# Altium project IMX385_EVB_revA.PrjPcb
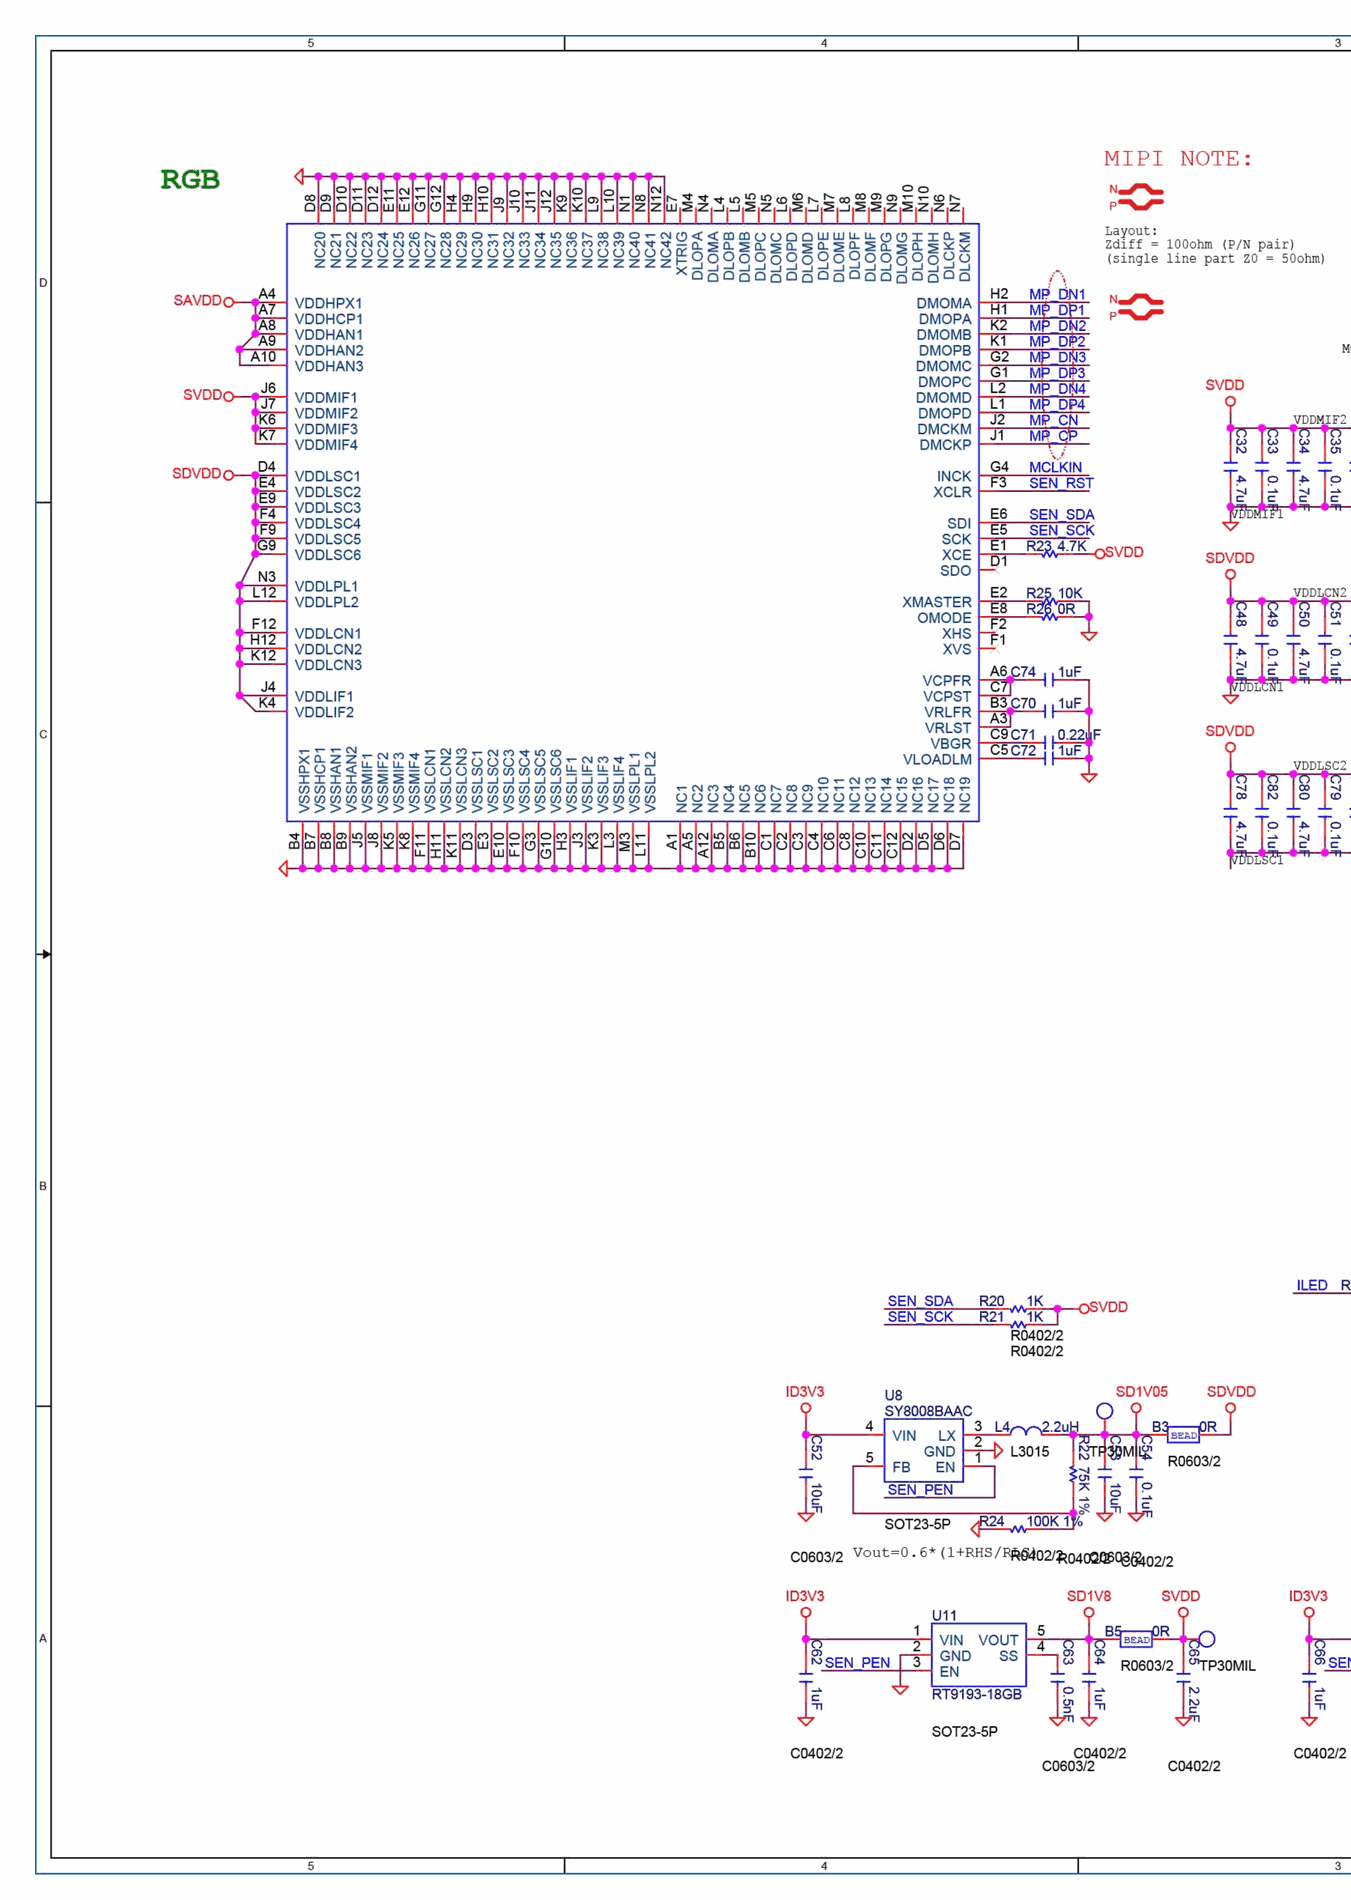
[diagram p0: IMX385_EVB_revA.SchDoc, top left]
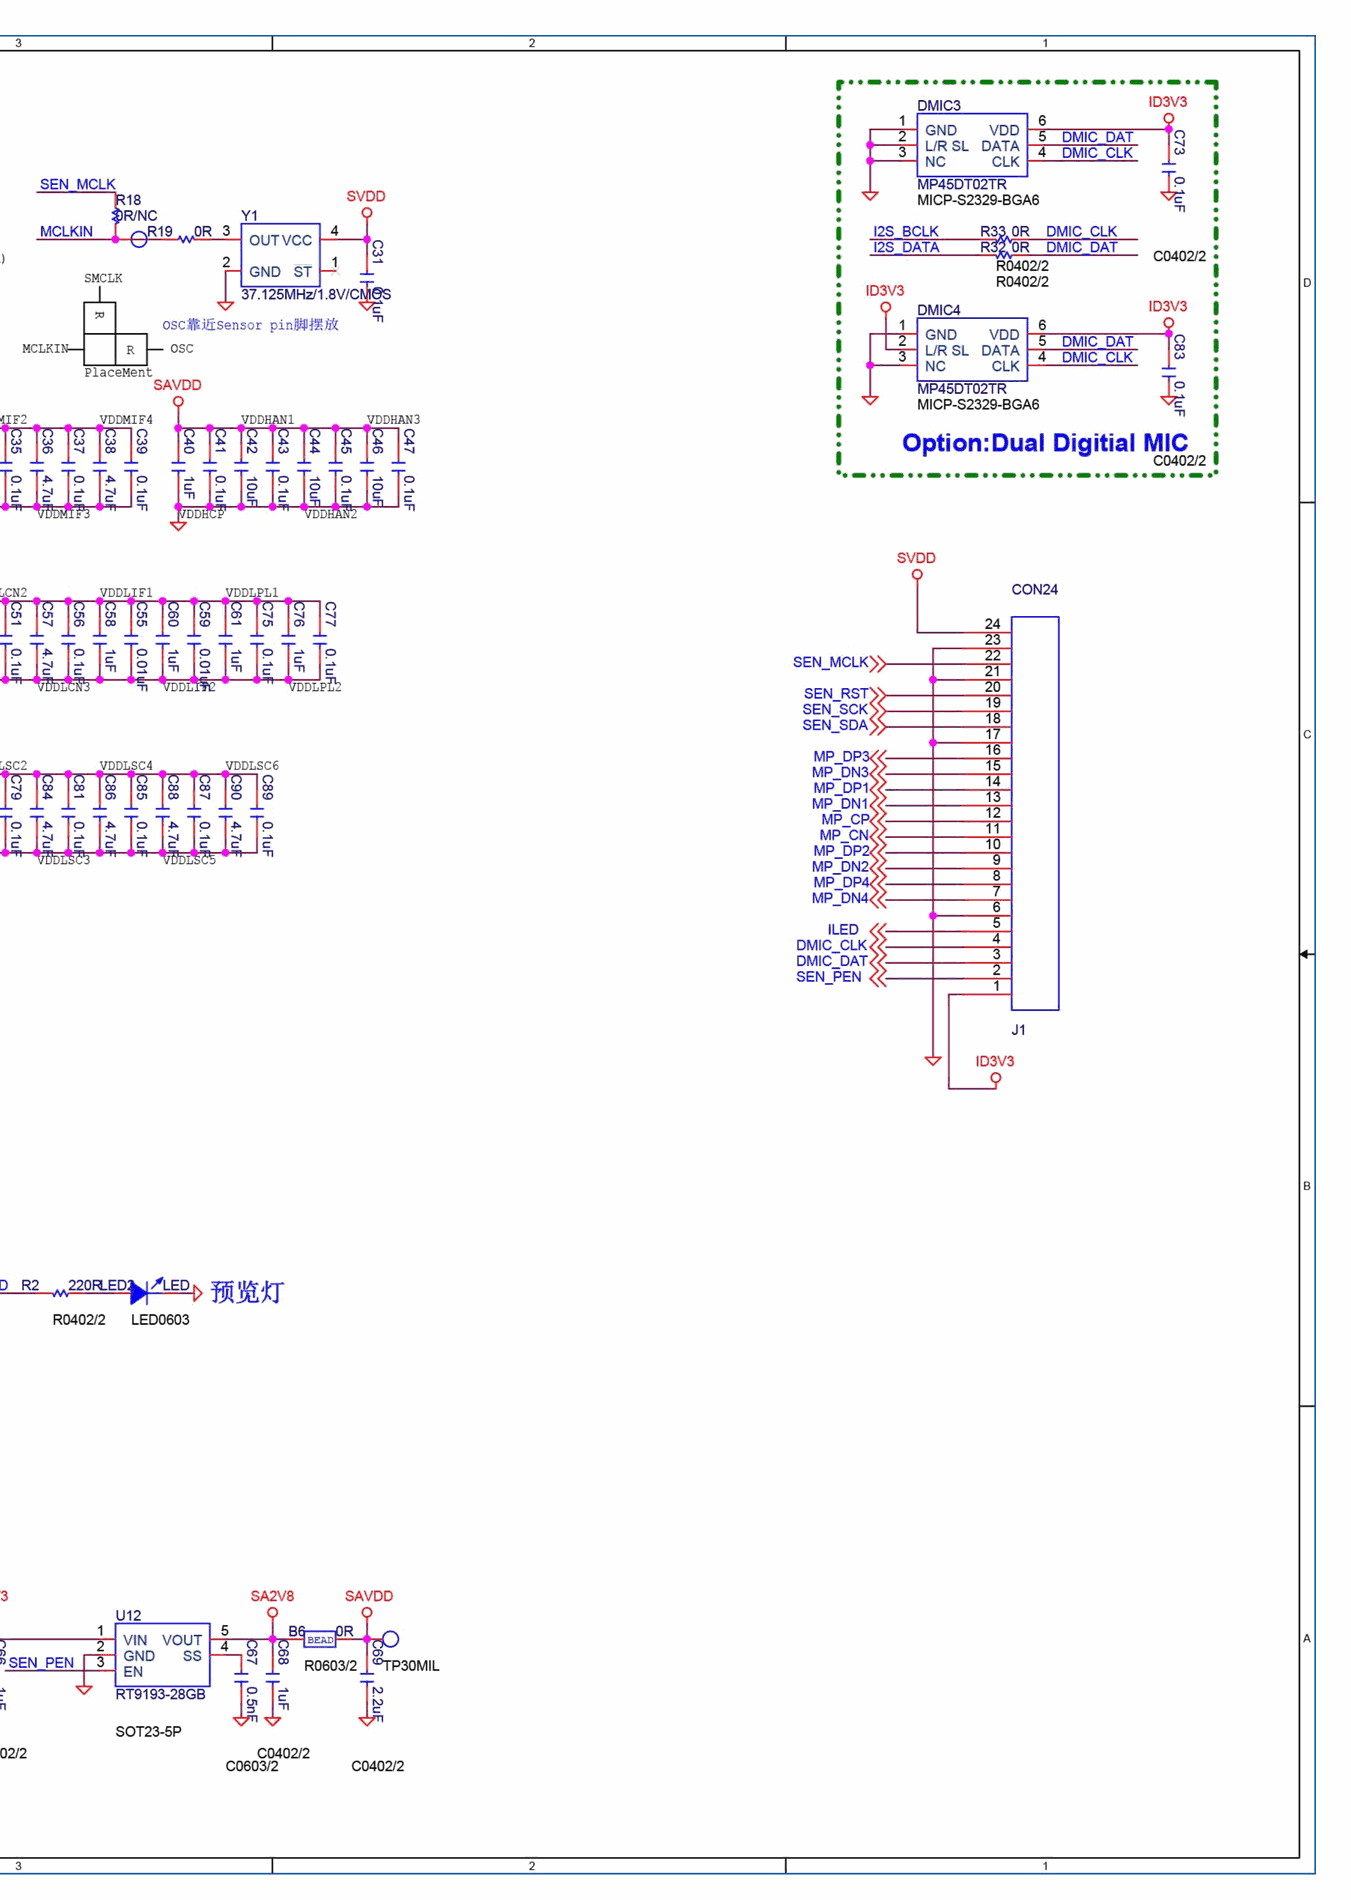
[diagram p1: IMX385_EVB_revA.SchDoc, top right]
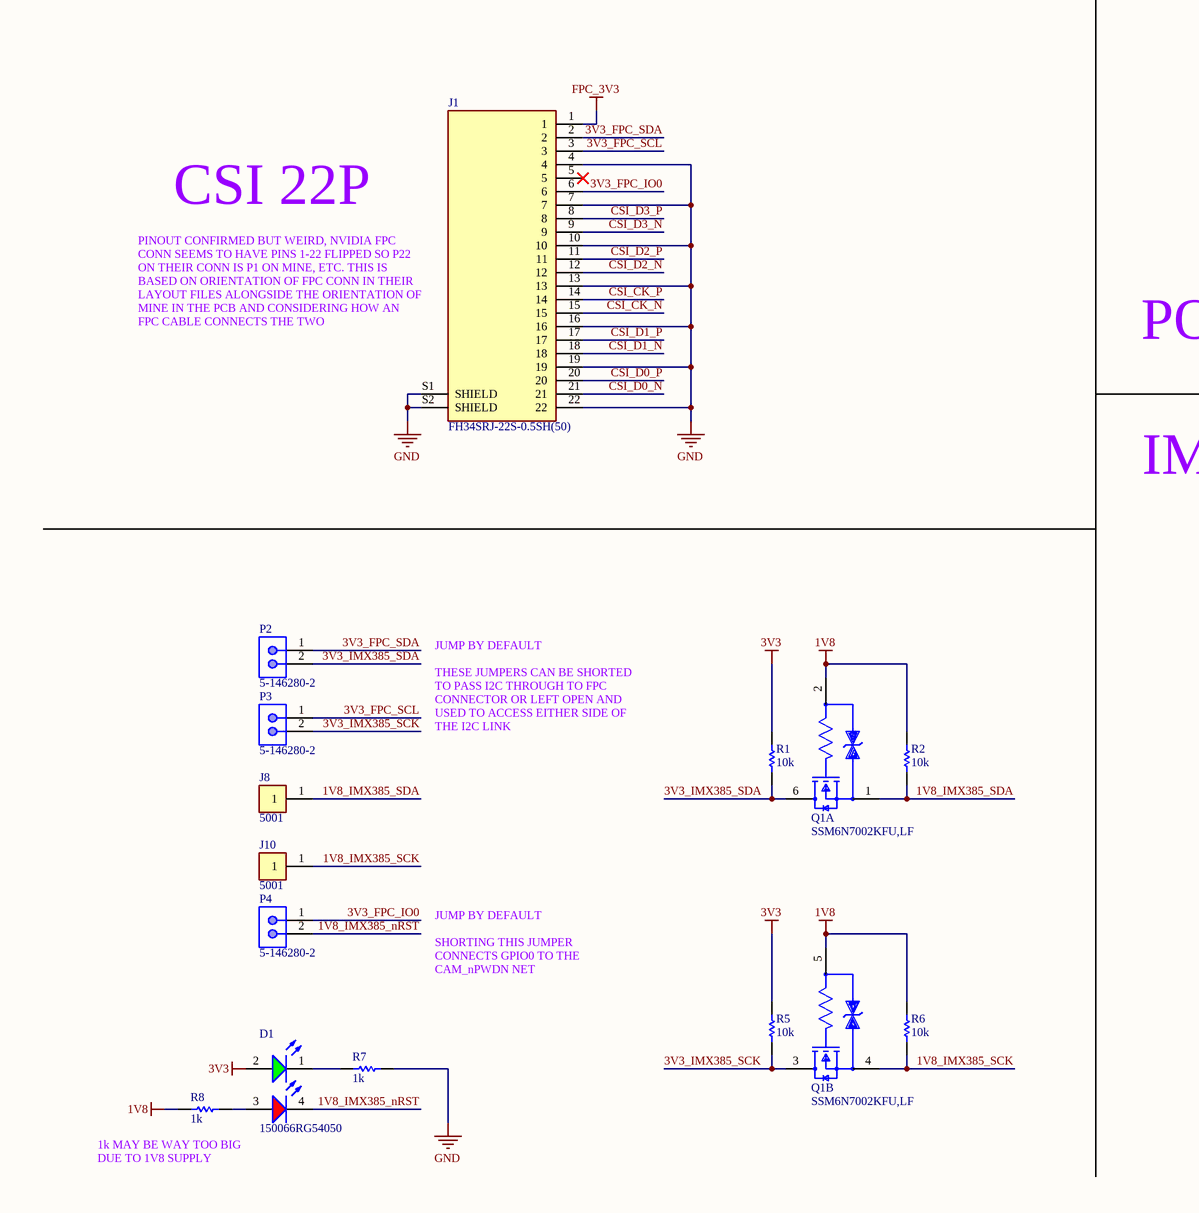
[diagram p2: IMX385_EVB_revA.SchDoc, bottom left]
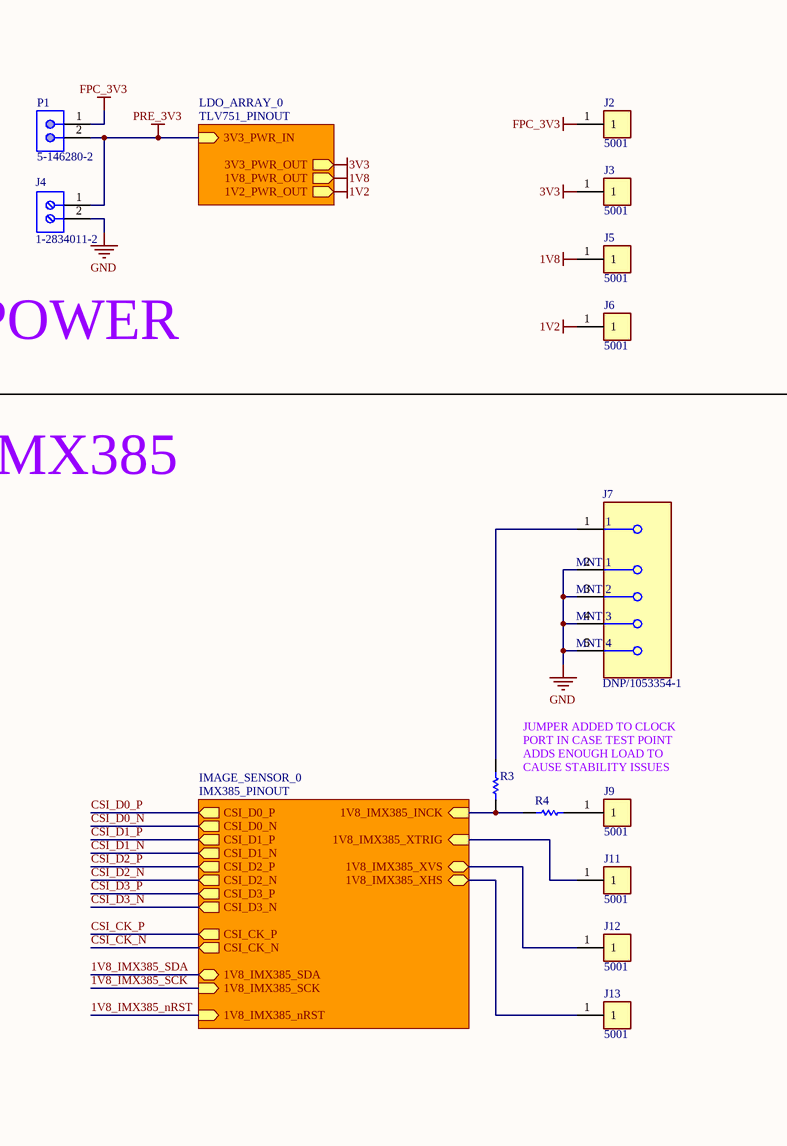
[diagram p3: IMX385_EVB_revA.SchDoc, bottom right]
3 sheets, 109 parts. Net scope: hierarchical (ports join the sheet entries above them; power ports are global).
Board file: IMX385_EVB_revA.PcbDoc
Sheets:
  IMX385_EVB_revA.SchDoc
    IMAGE_SENSOR_0 = IMX385_PINOUT.SchDoc
    LDO_ARRAY_0 = TLV751_PINOUT.SchDoc

## Sheet IMX385_EVB_revA.SchDoc
size B; SheetNumber: 1; SheetTotal: 3

### Parts
D1  150066RG54050  [WL-SBCD_0606]
J1  FH34SRJ-22S-0.5SH(50)  [FH34SRJ-22S-0.5SH(50)-Footprint-1]
J2  5001  [FP-5001-MFG]
J3  5001  [FP-5001-MFG]
J4  1-2834011-2  [1-2834011-2-Footprint-1]
J5  5001  [FP-5001-MFG]
J6  5001  [FP-5001-MFG]
J7  DNP/1053354-1  [FP-1053354-1-MFG]
J8  5001  [FP-5001-MFG]
J9  5001  [FP-5001-MFG]
J10  5001  [FP-5001-MFG]
J11  5001  [FP-5001-MFG]
J12  5001  [FP-5001-MFG]
J13  5001  [FP-5001-MFG]
P1  5-146280-2  [TECO-5-146280-2_V]
P2  5-146280-2  [TECO-5-146280-2_V]
P3  5-146280-2  [TECO-5-146280-2_V]
P4  5-146280-2  [TECO-5-146280-2_V]
Q1  SSM6N7002KFU,LF  [FP-SSOP6-P-0_65A-MFG]  (parts A,B of 2)
R1  10k  [R0603B]
R2  10k  [R0603B]
R3  DNP  [RESC1005X40X25ML05T05]  (value not drawn)
R4  0402 JUMPER  [RESC1005X40X25ML05T05]  (value not drawn)
R5  10k  [R0603B]
R6  10k  [R0603B]
R7  1k  [R0603B]
R8  1k  [R0603B]

### Sub-sheets
IMAGE_SENSOR_0 = IMX385_PINOUT: CSI_D0_P (out), CSI_D0_N (out), CSI_D1_P (out), CSI_D1_N (out), CSI_D2_P (out), CSI_D2_N (out), CSI_D3_P (out), CSI_D3_N (out), CSI_CK_P (out), CSI_CK_N (out), 1V8_IMX385_SDA (bidir), 1V8_IMX385_SCK (in), 1V8_IMX385_nRST (in), 1V8_IMX385_INCK (in), 1V8_IMX385_XHS (bidir), 1V8_IMX385_XVS (bidir), 1V8_IMX385_XTRIG (in)
LDO_ARRAY_0 = TLV751_PINOUT: 3V3_PWR_IN (in), 1V2_PWR_OUT (out), 1V8_PWR_OUT (out), 3V3_PWR_OUT (out)

### Nets
1V2: J6.1 ; sheet LDO_ARRAY_0/1V2_PWR_OUT  [project net 1V2_PWR_OUT]
1V8: J5.1 Q1.2(Gate1) Q1.5(Gate2) R2.2 R6.2 R8.2 ; sheet LDO_ARRAY_0/1V8_PWR_OUT  [project net 1V8_PWR_OUT]
3V3: D1.2(A) J3.1 R1.2 R5.2 ; sheet LDO_ARRAY_0/3V3_PWR_OUT
FPC_3V3: J1.1 J2.1 P1.1
GND: J1.4 J1.7 J1.10 J1.13 J1.16 J1.19 J1.22 J1.S1(SHIELD) J1.S2(SHIELD) J4.2 J7.2(MNT_1) J7.3(MNT_2) J7.4(MNT_3) J7.5(MNT_4) R7.1
PRE_3V3: J4.1 P1.2 ; sheet LDO_ARRAY_0/3V3_PWR_IN  [project net 3V3_PWR_IN]
1V8_IMX385_INCK: R3.1 R4.1 ; sheet IMAGE_SENSOR_0/1V8_IMX385_INCK
1V8_IMX385_nRST: D1.4(K) P4.2 ; sheet IMAGE_SENSOR_0/1V8_IMX385_nRST
1V8_IMX385_SCK: J10.1 Q1.4(Source2) R6.1 ; sheet IMAGE_SENSOR_0/1V8_IMX385_SCK
1V8_IMX385_SDA: J8.1 Q1.1(Source1) R2.1 ; sheet IMAGE_SENSOR_0/1V8_IMX385_SDA
1V8_IMX385_XHS: J13.1 ; sheet IMAGE_SENSOR_0/1V8_IMX385_XHS
1V8_IMX385_XTRIG: J11.1 ; sheet IMAGE_SENSOR_0/1V8_IMX385_XTRIG
1V8_IMX385_XVS: J12.1 ; sheet IMAGE_SENSOR_0/1V8_IMX385_XVS
3V3_FPC_IO0: J1.6 P4.1
3V3_FPC_SCL: J1.3 P3.1
3V3_FPC_SDA: J1.2 P2.1
3V3_IMX385_SCK: P3.2 Q1.3(Drain2) R5.1
3V3_IMX385_SDA: P2.2 Q1.6(Drain1) R1.1
CSI_CK_N: J1.15 ; sheet IMAGE_SENSOR_0/CSI_CK_N
CSI_CK_P: J1.14 ; sheet IMAGE_SENSOR_0/CSI_CK_P
CSI_D0_N: J1.21 ; sheet IMAGE_SENSOR_0/CSI_D0_N
CSI_D0_P: J1.20 ; sheet IMAGE_SENSOR_0/CSI_D0_P
CSI_D1_N: J1.18 ; sheet IMAGE_SENSOR_0/CSI_D1_N
CSI_D1_P: J1.17 ; sheet IMAGE_SENSOR_0/CSI_D1_P
CSI_D2_N: J1.12 ; sheet IMAGE_SENSOR_0/CSI_D2_N
CSI_D2_P: J1.11 ; sheet IMAGE_SENSOR_0/CSI_D2_P
CSI_D3_N: J1.9 ; sheet IMAGE_SENSOR_0/CSI_D3_N
CSI_D3_P: J1.8 ; sheet IMAGE_SENSOR_0/CSI_D3_P
NetD1_1: D1.1(K) R7.2
NetD1_3: D1.3(A) R8.1
NetJ7_1: J7.1 R3.2
NetJ9_1: J9.1 R4.2

Not connected (* = marked no-connect by the designer): J1 5*

### Notes on the sheet
- CSI 22P
- (near J1) PINOUT CONFIRMED BUT WEIRD, NVIDIA FPC CONN SEEMS TO HAVE PINS 1-22 FLIPPED SO P22 ON THEIR CONN IS P1 ON MINE, ETC. THIS IS BASED ON ORIENTATION OF FPC CONN IN THEIR LAYOUT FILES ALONGSIDE THE ORIENTATION OF MINE IN THE PCB AND CONSIDERING HOW AN FPC CABLE CONNECTS THE TWO
- POWER
- IMX385
- JUMP BY DEFAULT
  THESE JUMPERS CAN BE SHORTED TO PASS I2C THROUGH TO FPC CONNECTOR OR LEFT OPEN AND USED TO ACCESS EITHER SIDE OF THE I2C LINK
- JUMPER ADDED TO CLOCK PORT IN CASE TEST POINT ADDS ENOUGH LOAD TO CAUSE STABILITY ISSUES
- JUMP BY DEFAULT
  SHORTING THIS JUMPER CONNECTS GPIO0 TO THE CAM_nPWDN NET
- 1k MAY BE WAY TOO BIG DUE TO 1V8 SUPPLY

### Library data of the parts
D1 = CMP-004-00040-2: Led, Red/Grn, 180Mcd/230Mcd, 624Nm/525Nm Rohs Compliant: Yes; Source: rgled.SchLib; Component Type: Standard; Design Item ID: CMP-004-00034-2; Pins: 4
J1 = CMP-002-00104-1: 0.5Mm Pitch, 1.0Mm Height, Top And Bottom Contact, Back-Flip; Connector Type: Receptacle; Pins: 22; Min Operating Temperature: -55°C; Max Operating Temperature: 105°C; Mounting Technology: Surface Mount
J2 J3 J5 J6 J8-J13 = CMP-2000-05181-2: PC TEST POINT MINIATURE BLACK; Body Material: Bronze; Plating: Silver; Inside Diameter: 1.27mm; Hole Diameter: 1.6mm; Number of Ports: 1; Outside Diameter: 2.54mm; Insulation: Insulated; Insulation Material: Nylon; Mount: Through Hole; RoHS Compliant: Yes; Series: THM; Height: 0.3inch; Termination: Through Hole; Material: Nylon; Packaging: Bulk; Contact Material: Bronze; REACH SVHC: No SVHC; Contact Plating: Silver; Orientation: Straight; Lead Free: Lead Free; Package Quantity: 100; Length: 7.62mm; Flammability Rating: UL94 V-0; Number of Contacts: 1; Diameter: 2.54mm; Housing Color: Black; Color: Black
J4 = CMP-002-00067-1: Barrier Strip Terminal Block; RoHS Compliant: Yes
J7 = CMP-2000-05830-2: CONN SMA JACK STR 50 OHM PCB; Dielectric Material: PTFE; Impedance: 50R; Frequency: 18GHz; Polarity: Normal; Body Material: Stainless Steel; Max Frequency: 12.4GHz; Center Contact Plating: Gold; PCB Mounting Orientation: Vertical; Mating Cycles: 500; Gender: Female; Number of Ports: 1; Packaging: Bag; Contact Plating: Gold; REACH SVHC: No SVHC; Radiation Hardening: No; Mount: Through Hole; Fastening Type: Threaded; Package Quantity: 125; Connector Type: SMA; Operating Frequency: N/A; Height: 9.5mm; Plating: Gold; RoHS Compliant: Yes; Insulation Material: Polytetrafluoroethylene; Length: 9.53mm; Contact Material: Copper; Orientation: Straight; Case/Package: SMA; Depth: 6.3mm; Series: SMA; Termination: Solder; Housing Color: Gold; Body Plating: Gold
P1-P4 = CMP-2000-07492-1: Male Header, Pitch 2.54 mm, 1 x 2 Position, Height 8.21 mm, Tail Length 3.05 mm, -65 to 105 degC, RoHS, Bulk; Manufacturer: TE Connectivity; Mating Connector Lock: No(Without); Number of Positions: 2; Pitch: 2.54mm; PCB Mounting Orientation: Vertical; Keyed: No; Case\/Package: 100; Mating Post Length: 0.23inch; High Temperature Housing: Yes; Max Current Rating: 5A; PCB Thickness: 0.063inch; PCB Mount Retention: Without; Approvals: CSA; Current Rating: 3A; Radiation Hardening: No; Length: 4.67mm; Contact Mating Length: 0.23inch; Connector Type: Header; Number of Rows: 1; Termination Post Length: 0.12inch; Board Standoff: No(Without); Max Operating Temperature: 105degC; Contact Shape: Square; Selectively Loaded: No(Without); Gasket: No(Without); Number of Contacts: 2; Contact Gender: Male; Mating Alignment: No(Without); Manufacturer URL: http://www.te.com/; Datasheet URL: http://www.te.com/commerce/DocumentDelivery/DDEController?Action=showdoc&DocId=Customer+Drawing%7F146280%7FH1%7Fpdf%7FEnglish%7FENG_CD_146280_H1.pdf%7F5-146280-2; Mount: ThroughHole; Orientation: Straight; Packaging: Carton; Package Reference: 5-146280-2; Package Quantity: 500; Stabilizers: No(Without); Row Spacing: 2.54mm; Contact Material: CopperAlloy; Panel Mount Retention: No(Without); Datasheet Version: Rev. H1, 08/2016; Housing Colour: Black; Colour: Black; Package Description: Male Header, Pitch 2.54 mm, 1 x 2 Position, Height 8.21 mm, Tail Length 3.05 mm; Contact Plating: Matte; Housing Material: Polymer; Contact Protection: No(Without); Min Operating Temperature: -65degC; Mounting Technology: ThroughHole; Flammability Rating: UL94V-0; RoHSCompliant: true; Termination: ThroughHole; Depth: 2.34mm; High Speed Serial Data Connector: No
Q1 = CMP-35916-000009-1: MOSFET 2N-CH 60V 0.3A; Input Capacitance: 40pF; Continuous Drain Current (ID): 300mA; Max Power Dissipation: 285mW; FET Type: 2 N-Channel; Rds On Max: 1.5R; Mount: Surface Mount; Drain to Source Voltage (Vdss): 60V; Packaging: Tape and Reel
R1 R2 R5-R8 = CMP-009-00002-14: Resistor
  R1 R2 R5 R6: Value: 10k
R3 R4 = CMP-009-00118-2: READ THE NAME; Pins: 2; Component Type: Standard; Design Item ID: CMP-009-00206-2; Source: 0402jump.SchLib

## Sheet IMX385_PINOUT.SchDoc
size C; SheetNumber: 2; SheetTotal: 3
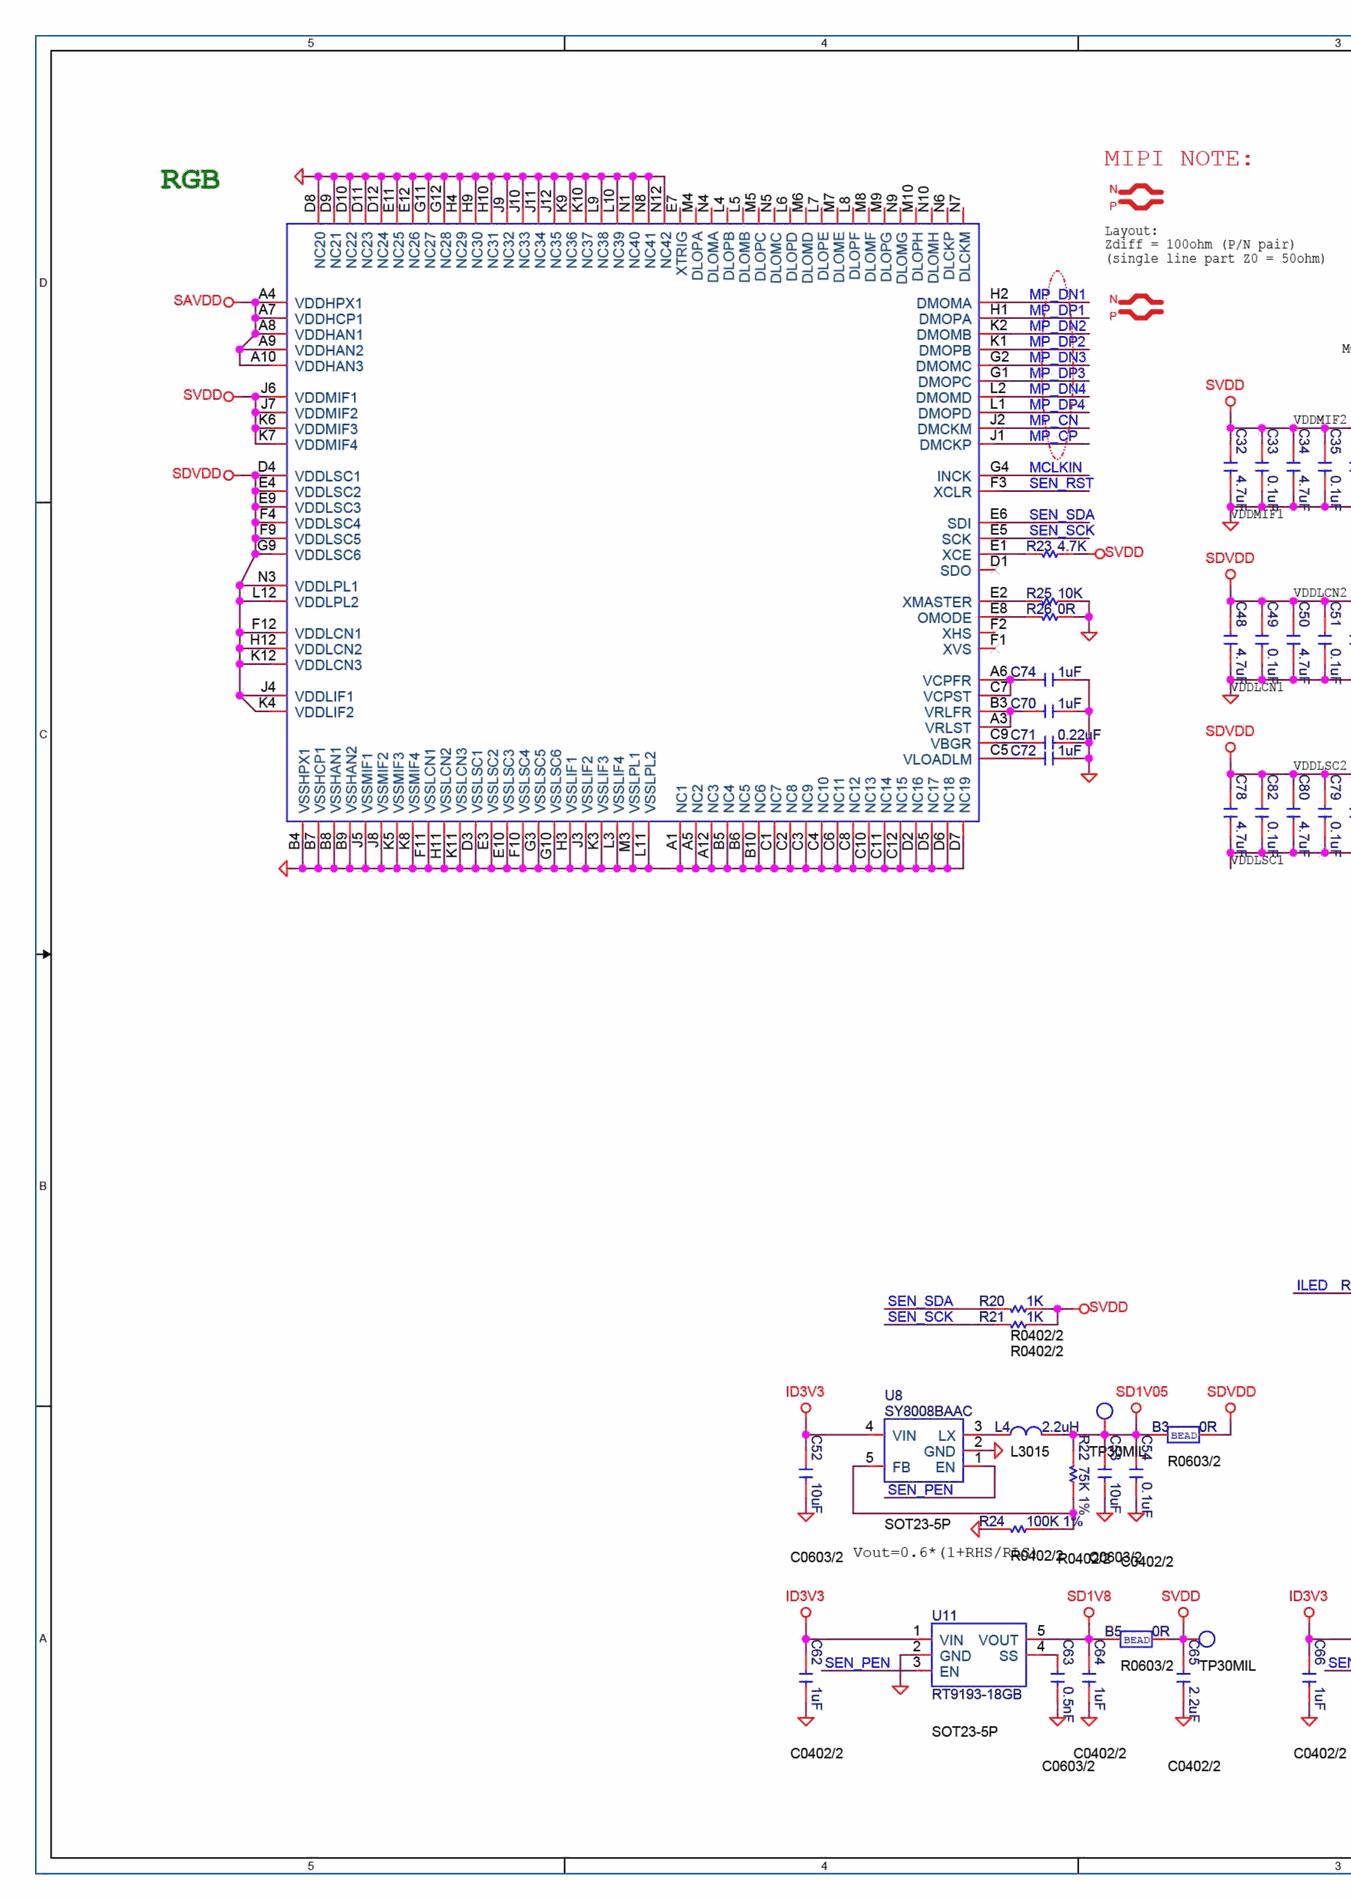
[diagram p4: IMX385_PINOUT.SchDoc, top left]
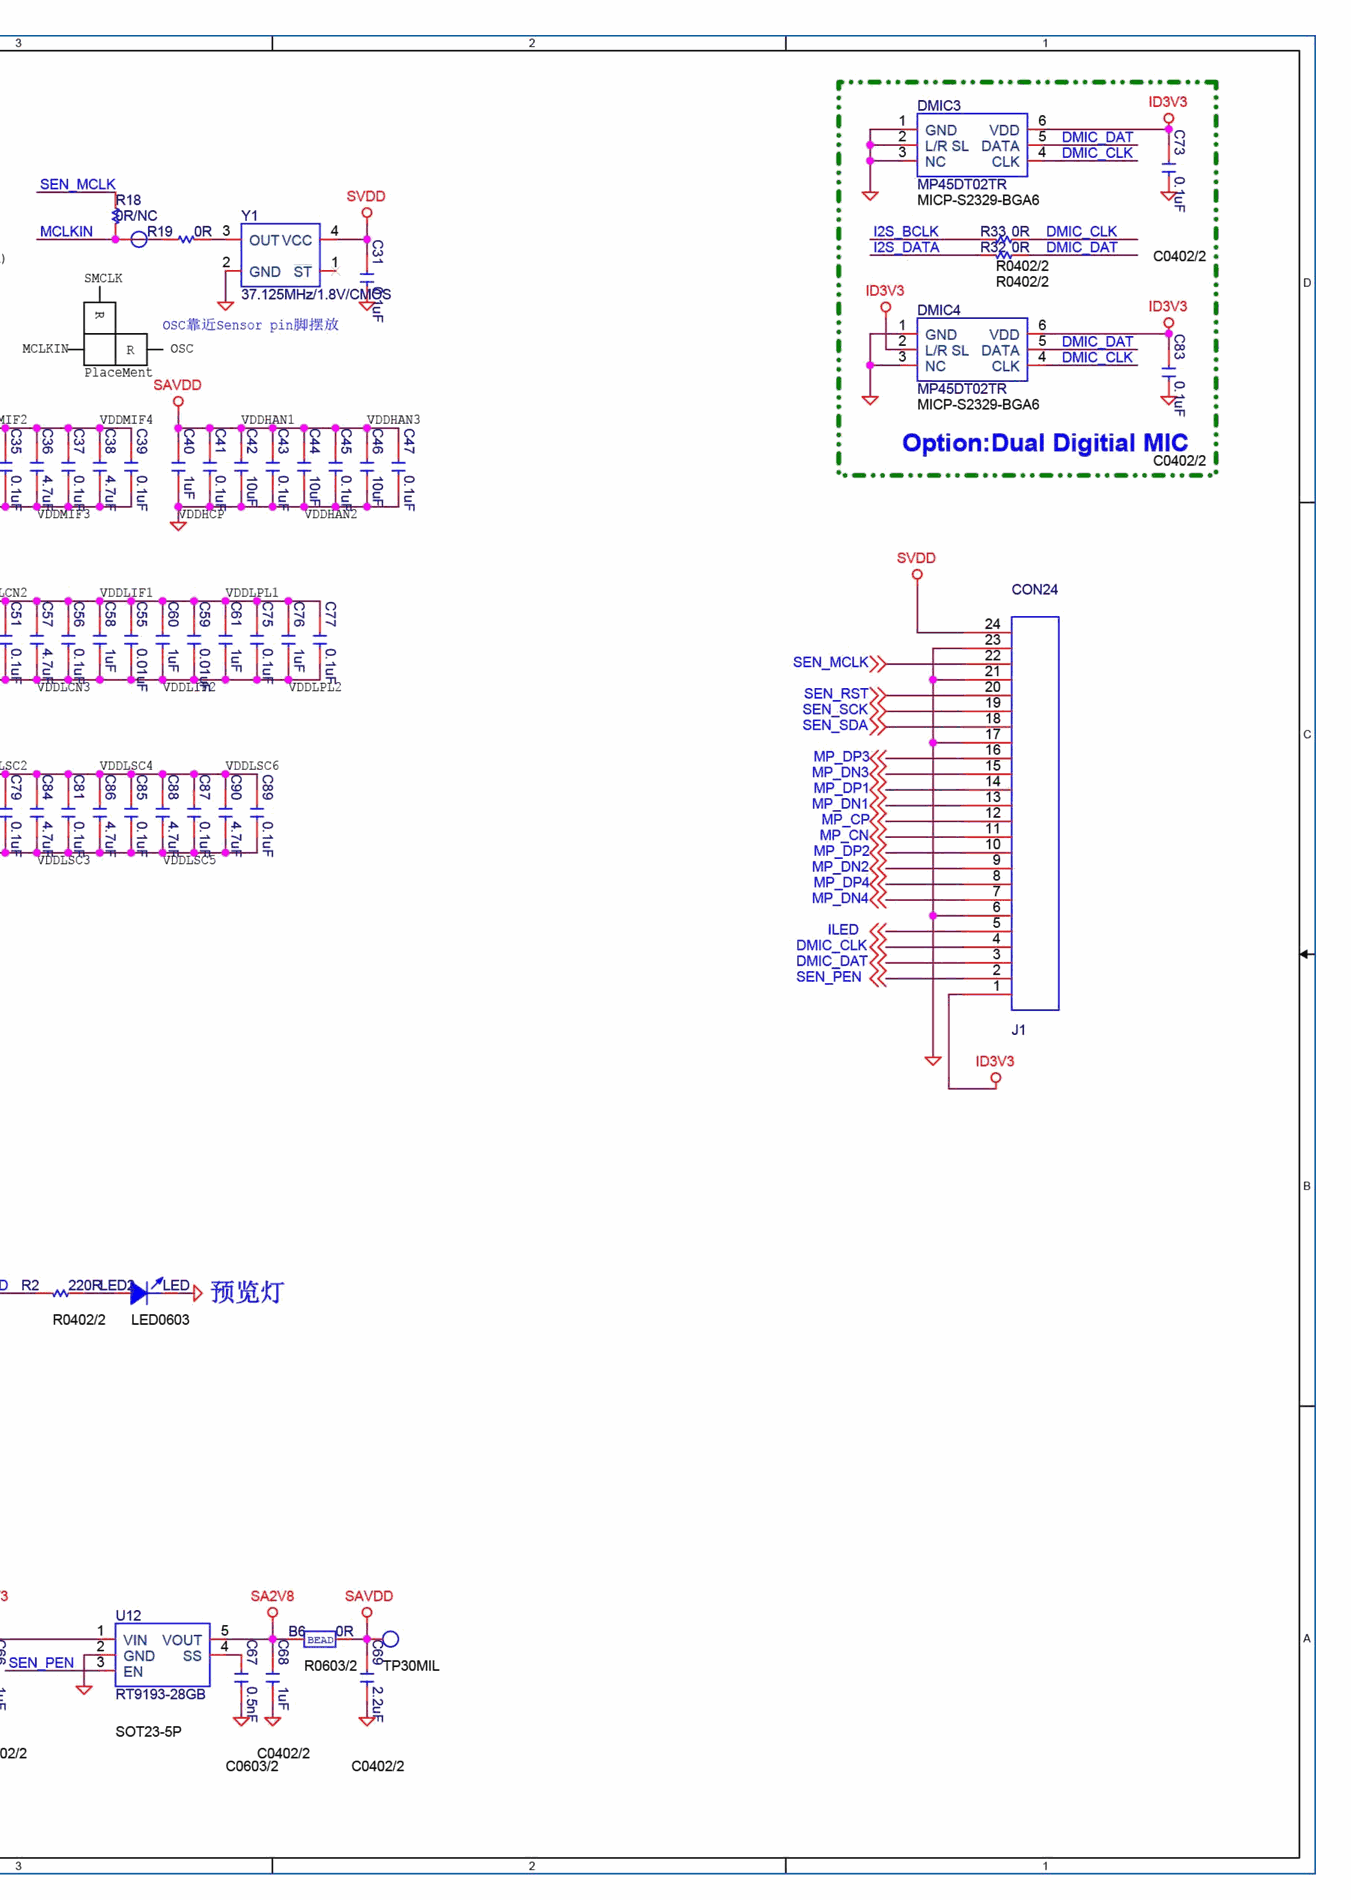
[diagram p5: IMX385_PINOUT.SchDoc, top right]
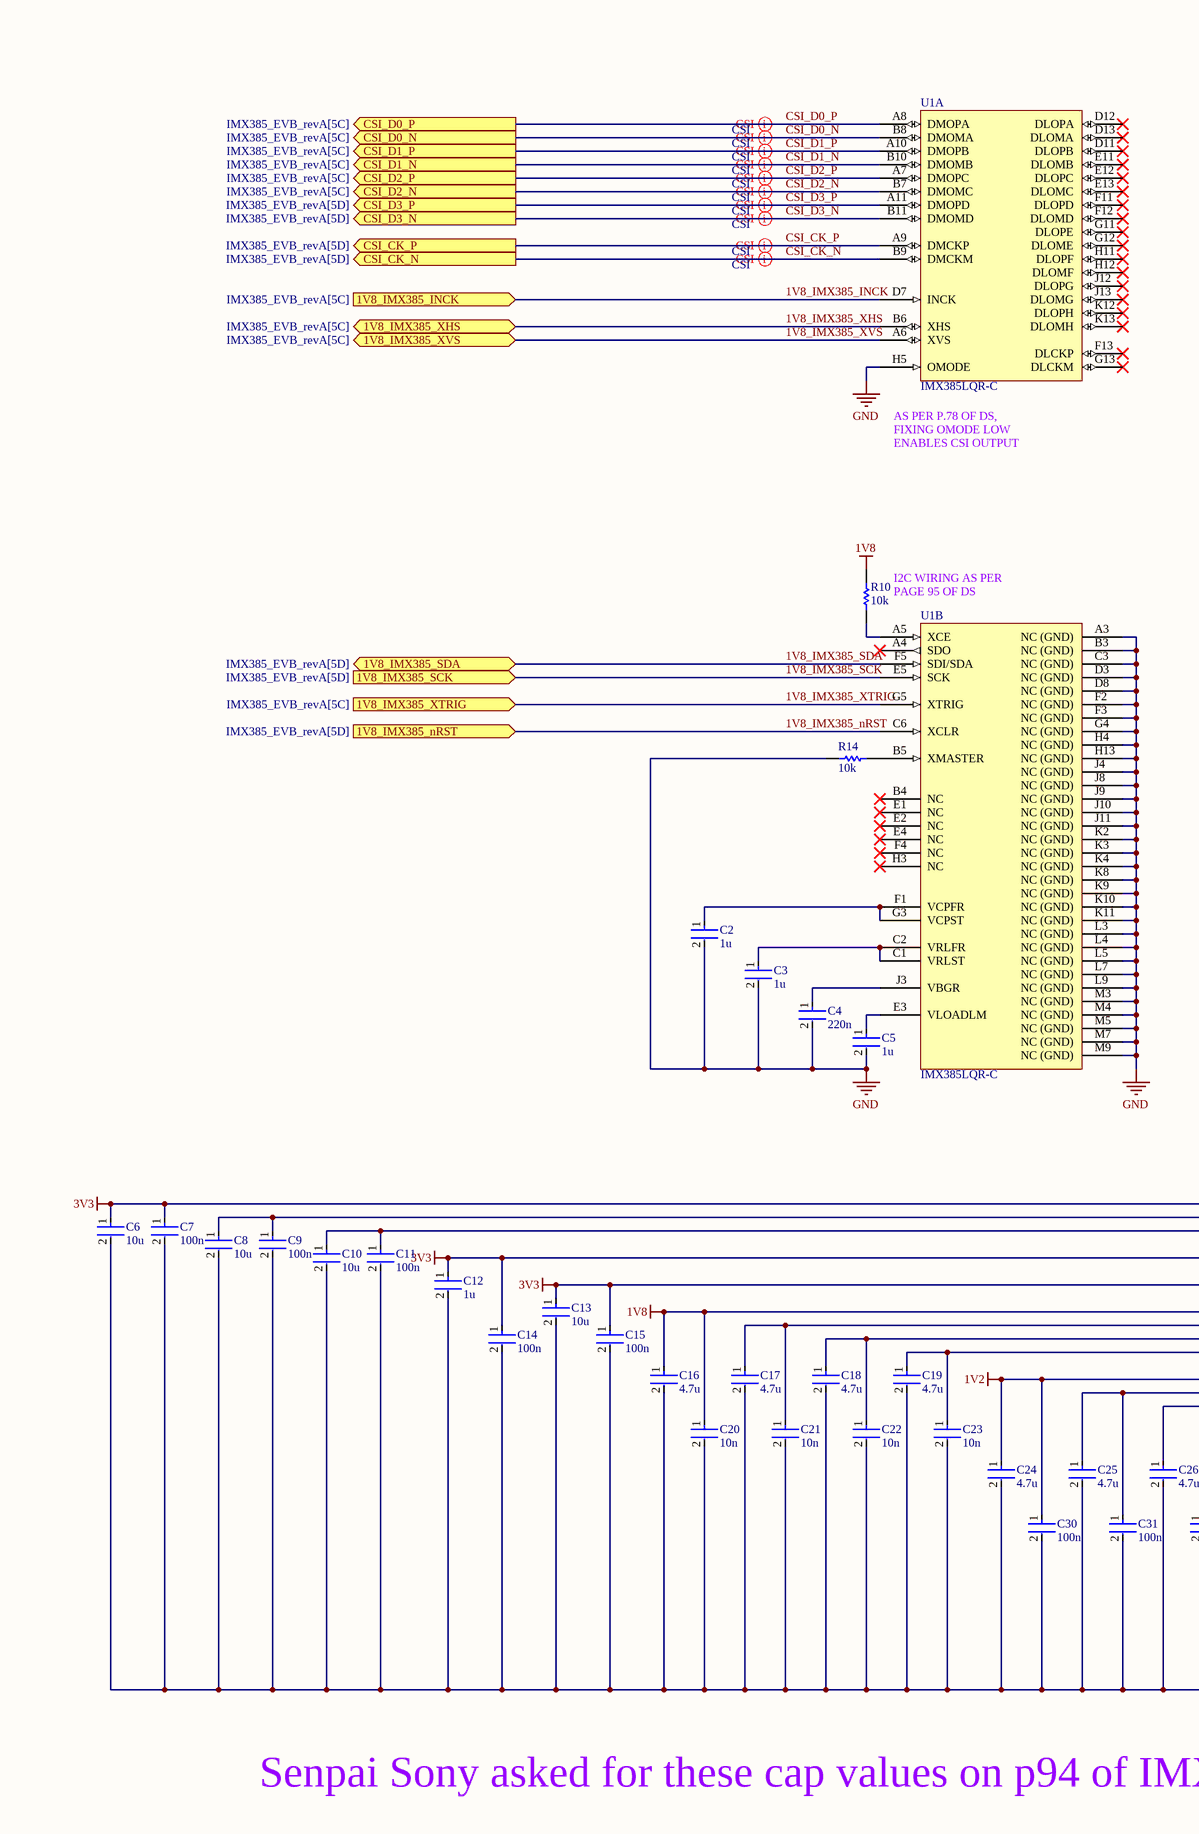
[diagram p6: IMX385_PINOUT.SchDoc, bottom left]
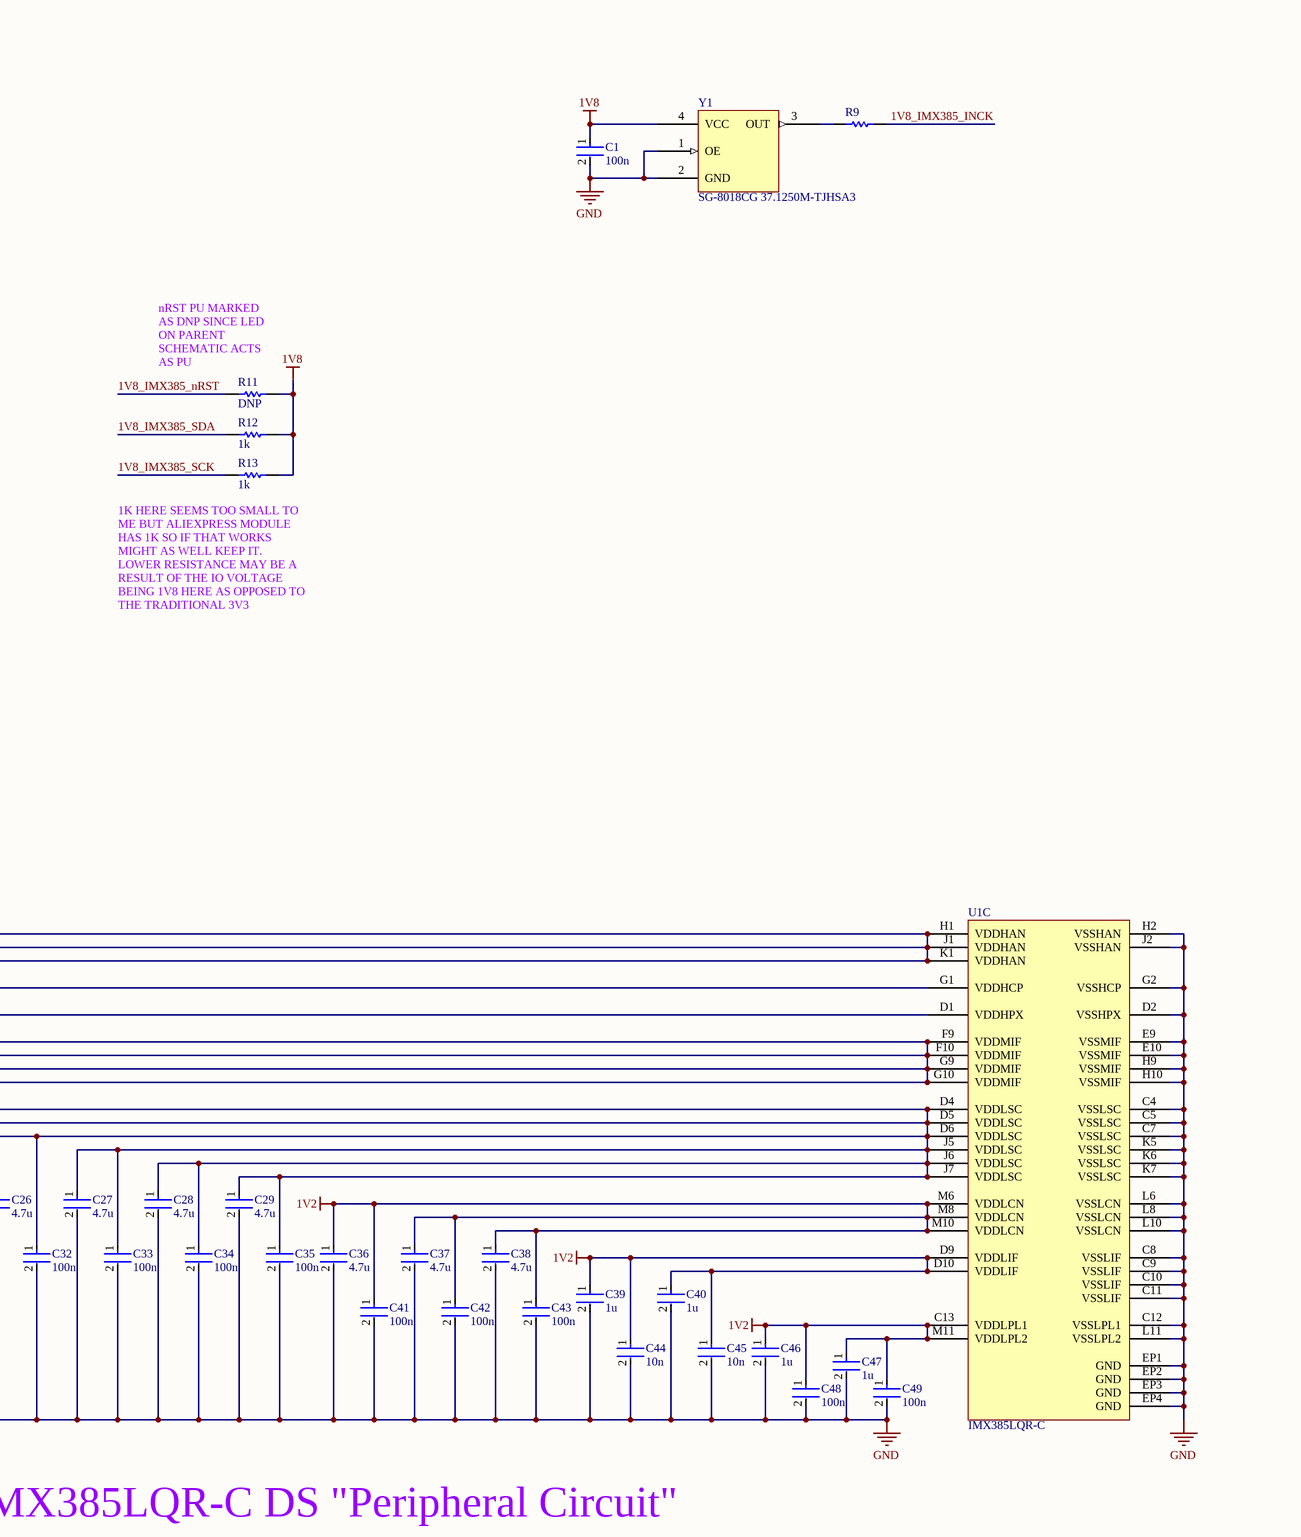
[diagram p7: IMX385_PINOUT.SchDoc, bottom right]

### Parts
C1  100n  [FP-0402-L_1_0_0_05-W_0_5-IPC_A]
C2  1u  [FP-0402-L_1_0_0_05-W_0_5-IPC_A]
C3  1u  [FP-0402-L_1_0_0_05-W_0_5-IPC_A]
C4  220n  [FP-0402-L_1_0_0_05-W_0_5-IPC_A]
C5  1u  [FP-0402-L_1_0_0_05-W_0_5-IPC_A]
C6  10u  [FP-0402-L_1_0_0_05-W_0_5-IPC_A]
C7  100n  [FP-0402-L_1_0_0_05-W_0_5-IPC_A]
C8  10u  [FP-0402-L_1_0_0_05-W_0_5-IPC_A]
C9  100n  [FP-0402-L_1_0_0_05-W_0_5-IPC_A]
C10  10u  [FP-0402-L_1_0_0_05-W_0_5-IPC_A]
C11  100n  [FP-0402-L_1_0_0_05-W_0_5-IPC_A]
C12  1u  [FP-0402-L_1_0_0_05-W_0_5-IPC_A]
C13  10u  [FP-0402-L_1_0_0_05-W_0_5-IPC_A]
C14  100n  [FP-0402-L_1_0_0_05-W_0_5-IPC_A]
C15  100n  [FP-0402-L_1_0_0_05-W_0_5-IPC_A]
C16  4.7u  [FP-0402-L_1_0_0_05-W_0_5-IPC_A]
C17  4.7u  [FP-0402-L_1_0_0_05-W_0_5-IPC_A]
C18  4.7u  [FP-0402-L_1_0_0_05-W_0_5-IPC_A]
C19  4.7u  [FP-0402-L_1_0_0_05-W_0_5-IPC_A]
C20  10n  [FP-0402-L_1_0_0_05-W_0_5-IPC_A]
C21  10n  [FP-0402-L_1_0_0_05-W_0_5-IPC_A]
C22  10n  [FP-0402-L_1_0_0_05-W_0_5-IPC_A]
C23  10n  [FP-0402-L_1_0_0_05-W_0_5-IPC_A]
C24  4.7u  [FP-0402-L_1_0_0_05-W_0_5-IPC_A]
C25  4.7u  [FP-0402-L_1_0_0_05-W_0_5-IPC_A]
C26  4.7u  [FP-0402-L_1_0_0_05-W_0_5-IPC_A]
C27  4.7u  [FP-0402-L_1_0_0_05-W_0_5-IPC_A]
C28  4.7u  [FP-0402-L_1_0_0_05-W_0_5-IPC_A]
C29  4.7u  [FP-0402-L_1_0_0_05-W_0_5-IPC_A]
C30  100n  [FP-0402-L_1_0_0_05-W_0_5-IPC_A]
C31  100n  [FP-0402-L_1_0_0_05-W_0_5-IPC_A]
C32  100n  [FP-0402-L_1_0_0_05-W_0_5-IPC_A]
C33  100n  [FP-0402-L_1_0_0_05-W_0_5-IPC_A]
C34  100n  [FP-0402-L_1_0_0_05-W_0_5-IPC_A]
C35  100n  [FP-0402-L_1_0_0_05-W_0_5-IPC_A]
C36  4.7u  [FP-0402-L_1_0_0_05-W_0_5-IPC_A]
C37  4.7u  [FP-0402-L_1_0_0_05-W_0_5-IPC_A]
C38  4.7u  [FP-0402-L_1_0_0_05-W_0_5-IPC_A]
C39  1u  [FP-0402-L_1_0_0_05-W_0_5-IPC_A]
C40  1u  [FP-0402-L_1_0_0_05-W_0_5-IPC_A]
C41  100n  [FP-0402-L_1_0_0_05-W_0_5-IPC_A]
C42  100n  [FP-0402-L_1_0_0_05-W_0_5-IPC_A]
C43  100n  [FP-0402-L_1_0_0_05-W_0_5-IPC_A]
C44  10n  [FP-0402-L_1_0_0_05-W_0_5-IPC_A]
C45  10n  [FP-0402-L_1_0_0_05-W_0_5-IPC_A]
C46  1u  [FP-0402-L_1_0_0_05-W_0_5-IPC_A]
C47  1u  [FP-0402-L_1_0_0_05-W_0_5-IPC_A]
C48  100n  [FP-0402-L_1_0_0_05-W_0_5-IPC_A]
C49  100n  [FP-0402-L_1_0_0_05-W_0_5-IPC_A]
R9  0402 JUMPER  [RESC1005X40X25ML05T05]  (value not drawn)
R10  10k  [R0603B]
R11  DNP  [R0603B]
R12  1k  [R0603B]
R13  1k  [R0603B]
R14  10k  [R0603B]
U1  IMX385LQR-C  [BGA128C100P13X12_1500X1250X225]  (parts A,B,C of 3)
Y1  SG-8018CG 37.1250M-TJHSA3  [SG-8018CG 37.1250M-TJHSA3-Footprint-1]

### Ports
1V8_IMX385_INCK (in, see IMX385_EVB_revA[5C]), 1V8_IMX385_nRST (in, see IMX385_EVB_revA[5D]), 1V8_IMX385_SCK (in, see IMX385_EVB_revA[5D]), 1V8_IMX385_SDA (bidir, see IMX385_EVB_revA[5D]), 1V8_IMX385_XHS (bidir, see IMX385_EVB_revA[5C]), 1V8_IMX385_XTRIG (in, see IMX385_EVB_revA[5C]), 1V8_IMX385_XVS (bidir, see IMX385_EVB_revA[5C]), CSI_CK_N (out, see IMX385_EVB_revA[5D]), CSI_CK_P (out, see IMX385_EVB_revA[5D]), CSI_D0_N (out, see IMX385_EVB_revA[5C]), CSI_D0_P (out, see IMX385_EVB_revA[5C]), CSI_D1_N (out, see IMX385_EVB_revA[5C]), CSI_D1_P (out, see IMX385_EVB_revA[5C]), CSI_D2_N (out, see IMX385_EVB_revA[5C]), CSI_D2_P (out, see IMX385_EVB_revA[5C]), CSI_D3_N (out, see IMX385_EVB_revA[5D]), CSI_D3_P (out, see IMX385_EVB_revA[5D])

### Nets
1V2: C24.1 C25.1 C26.1 C27.1 C28.1 C29.1 C30.1 C31.1 C32.1 C33.1 C34.1 C35.1 C36.1 C37.1 C38.1 C39.1 C40.1 C41.1 C42.1 C43.1 C44.1 C45.1 C46.1 C47.1 C48.1 C49.1 U1.C13(VDDLPL1) U1.D4(VDDLSC) U1.D5(VDDLSC) U1.D6(VDDLSC) U1.D9(VDDLIF) U1.D10(VDDLIF) U1.J5(VDDLSC) U1.J6(VDDLSC) U1.J7(VDDLSC) U1.M6(VDDLCN) U1.M8(VDDLCN) U1.M10(VDDLCN) U1.M11(VDDLPL2)  [project net 1V2_PWR_OUT]
1V8: C1.1 C16.1 C17.1 C18.1 C19.1 C20.1 C21.1 C22.1 C23.1 R10.2 R11.1 R12.2 R13.2 U1.F9(VDDMIF) U1.F10(VDDMIF) U1.G9(VDDMIF) U1.G10(VDDMIF) Y1.4(VCC)  [project net 1V8_PWR_OUT]
3V3: C6.1 C7.1 C8.1 C9.1 C10.1 C11.1 C12.1 C13.1 C14.1 C15.1 U1.D1(VDDHPX) U1.G1(VDDHCP) U1.H1(VDDHAN) U1.J1(VDDHAN) U1.K1(VDDHAN)
GND: C1.2 C2.2 C3.2 C4.2 C5.2 C6.2 C7.2 C8.2 C9.2 C10.2 C11.2 C12.2 C13.2 C14.2 C15.2 C16.2 C17.2 C18.2 C19.2 C20.2 C21.2 C22.2 C23.2 C24.2 C25.2 C26.2 C27.2 C28.2 C29.2 C30.2 C31.2 C32.2 C33.2 C34.2 C35.2 C36.2 C37.2 C38.2 C39.2 C40.2 C41.2 C42.2 C43.2 C44.2 C45.2 C46.2 C47.2 C48.2 C49.2 R14.2 U1.A3(NC_(GND)) U1.B3(NC_(GND)) U1.C3(NC_(GND)) U1.C4(VSSLSC) U1.C5(VSSLSC) U1.C7(VSSLSC) U1.C8(VSSLIF) U1.C9(VSSLIF) U1.C10(VSSLIF) U1.C11(VSSLIF) U1.C12(VSSLPL1) U1.D2(VSSHPX) U1.D3(NC_(GND)) U1.D8(NC_(GND)) U1.E9(VSSMIF) U1.E10(VSSMIF) U1.EP1(GND) U1.EP2(GND) U1.EP3(GND) U1.EP4(GND) U1.F2(NC_(GND)) U1.F3(NC_(GND)) U1.G2(VSSHCP) U1.G4(NC_(GND)) U1.H2(VSSHAN) U1.H4(NC_(GND)) U1.H5(OMODE) U1.H9(VSSMIF) U1.H10(VSSMIF) U1.H13(NC_(GND)) U1.J2(VSSHAN) U1.J4(NC_(GND)) U1.J8(NC_(GND)) U1.J9(NC_(GND)) U1.J10(NC_(GND)) U1.J11(NC_(GND)) U1.K2(NC_(GND)) U1.K3(NC_(GND)) U1.K4(NC_(GND)) U1.K5(VSSLSC) U1.K6(VSSLSC) U1.K7(VSSLSC) U1.K8(NC_(GND)) U1.K9(NC_(GND)) U1.K10(NC_(GND)) U1.K11(NC_(GND)) U1.L3(NC_(GND)) U1.L4(NC_(GND)) U1.L5(NC_(GND)) U1.L6(VSSLCN) U1.L7(NC_(GND)) U1.L8(VSSLCN) U1.L9(NC_(GND)) U1.L10(VSSLCN) U1.L11(VSSLPL2) U1.M3(NC_(GND)) U1.M4(NC_(GND)) U1.M5(NC_(GND)) U1.M7(NC_(GND)) U1.M9(NC_(GND)) Y1.1(OE) Y1.2(GND)
1V8_IMX385_INCK: R9.2 U1.D7(INCK) ; port 1V8_IMX385_INCK
1V8_IMX385_nRST: R11.2 U1.C6(XCLR) ; port 1V8_IMX385_nRST
1V8_IMX385_SCK: R13.1 U1.E5(SCK) ; port 1V8_IMX385_SCK
1V8_IMX385_SDA: R12.1 U1.F5(SDI/SDA) ; port 1V8_IMX385_SDA
1V8_IMX385_XHS: U1.B6(XHS) ; port 1V8_IMX385_XHS
1V8_IMX385_XTRIG: U1.G5(XTRIG) ; port 1V8_IMX385_XTRIG
1V8_IMX385_XVS: U1.A6(XVS) ; port 1V8_IMX385_XVS
CSI_CK_N: U1.B9(DMCKM) ; port CSI_CK_N
CSI_CK_P: U1.A9(DMCKP) ; port CSI_CK_P
CSI_D0_N: U1.B8(DMOMA) ; port CSI_D0_N
CSI_D0_P: U1.A8(DMOPA) ; port CSI_D0_P
CSI_D1_N: U1.B10(DMOMB) ; port CSI_D1_N
CSI_D1_P: U1.A10(DMOPB) ; port CSI_D1_P
CSI_D2_N: U1.B7(DMOMC) ; port CSI_D2_N
CSI_D2_P: U1.A7(DMOPC) ; port CSI_D2_P
CSI_D3_N: U1.B11(DMOMD) ; port CSI_D3_N
CSI_D3_P: U1.A11(DMOPD) ; port CSI_D3_P
NetC2_1: C2.1 U1.F1(VCPFR) U1.G3(VCPST)
NetC3_1: C3.1 U1.C1(VRLST) U1.C2(VRLFR)
NetC4_1: C4.1 U1.J3(VBGR)
NetC5_1: C5.1 U1.E3(VLOADLM)
NetR9_1: R9.1 Y1.3(OUT)
NetR10_1: R10.1 U1.A5(XCE)
NetR14_1: R14.1 U1.B5(XMASTER)

Not connected (* = marked no-connect by the designer): U1 A4(SDO)* B4(NC)* D11(DLOPB)* D12(DLOPA)* D13(DLOMA)* E1(NC)* E2(NC)* E4(NC)* E11(DLOMB)* E12(DLOPC)* E13(DLOMC)* F4(NC)* F11(DLOPD)* F12(DLOMD)* F13(DLCKP)* G11(DLOPE)* G12(DLOME)* G13(DLCKM)* H3(NC)* H11(DLOPF)* H12(DLOMF)* J12(DLOPG)* J13(DLOMG)* K12(DLOPH)* K13(DLOMH)*

### Layout directives
differential pair; differential pair class CSI: CSI_CK_N, CSI_CK_P, CSI_D0_N, CSI_D0_P, CSI_D1_N, CSI_D1_P, CSI_D2_N, CSI_D2_P, CSI_D3_N, CSI_D3_P

### Notes on the sheet
- (near U1) AS PER P.78 OF DS, FIXING OMODE LOW ENABLES CSI OUTPUT
- I2C WIRING AS PER PAGE 95 OF DS
- (near R11) nRST PU MARKED AS DNP SINCE LED ON PARENT SCHEMATIC ACTS AS PU
- (near R13) 1K HERE SEEMS TOO SMALL TO ME BUT ALIEXPRESS MODULE HAS 1K SO IF THAT WORKS MIGHT AS WELL KEEP IT. LOWER RESISTANCE MAY BE A RESULT OF THE IO VOLTAGE BEING 1V8 HERE AS OPPOSED TO THE TRADITIONAL 3V3
- Senpai Sony asked for these cap values on p94 of IMX385LQR-C DS "Peripheral Circuit"

### Library data of the parts
C1-C49 = CMP-001-00058-1: LARGE PADS, 0402 CAP, CHANGE COMMENT TO MATCH REAL P/N; Capacitor Type: Ceramic; Min Operating Temperature: -55°C; Mounting Technology: Surface Mount; Pins: 2; Case/Package: 0402; RoHS Compliant: Yes; Max Operating Temperature: 85°C
R9 = CMP-009-00118-2: READ THE NAME; Pins: 2; Component Type: Standard; Design Item ID: CMP-009-00206-2; Source: 0402jump.SchLib
R10 R12-R14 = CMP-009-00002-14: Resistor
  R10 R14: Value: 10k
  R12 R13: Value: 1k
R11 = CMP-009-00002-14: Resistor; Value: 10k
U1 = CMP-010-00040-3: Sony Starvis 2.13MP MIPI 1/2" Image Sensor
Y1 = CMP-003-00017-1: SG-8018CG 37.1250M-TJHSA3: Mhz Osc 1.8V~3.3V +/-50PPM -40~105C St 250TR; Load Capacitance: 15pF; Frequency: 37.125MHz; Mounting Technology: Surface Mount; Min Operating Temperature: -40°C; Max Operating Temperature: 105°C

## Sheet TLV751_PINOUT.SchDoc
size B; SheetNumber: 3; SheetTotal: 3
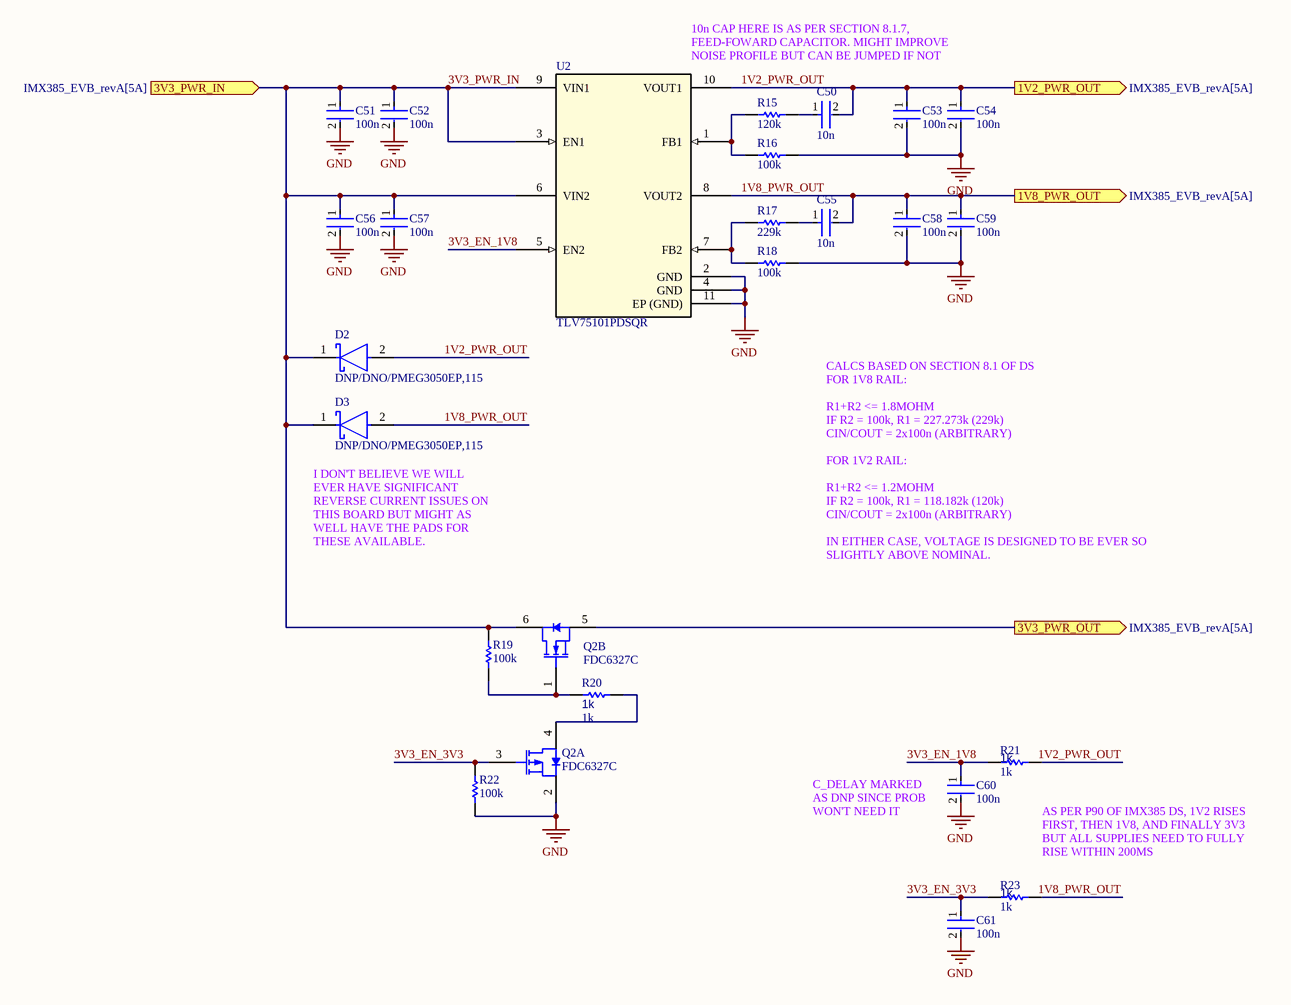
[diagram p8: TLV751_PINOUT.SchDoc]

### Parts
C50  10n  [FP-0402-L_1_0_0_05-W_0_5-IPC_A]
C51  100n  [FP-0402-L_1_0_0_05-W_0_5-IPC_A]
C52  100n  [FP-0402-L_1_0_0_05-W_0_5-IPC_A]
C53  100n  [FP-0402-L_1_0_0_05-W_0_5-IPC_A]
C54  100n  [FP-0402-L_1_0_0_05-W_0_5-IPC_A]
C55  10n  [FP-0402-L_1_0_0_05-W_0_5-IPC_A]
C56  100n  [FP-0402-L_1_0_0_05-W_0_5-IPC_A]
C57  100n  [FP-0402-L_1_0_0_05-W_0_5-IPC_A]
C58  100n  [FP-0402-L_1_0_0_05-W_0_5-IPC_A]
C59  100n  [FP-0402-L_1_0_0_05-W_0_5-IPC_A]
C60  100n  [FP-0402-L_1_0_0_05-W_0_5-IPC_A]
C61  100n  [FP-0402-L_1_0_0_05-W_0_5-IPC_A]
D2  DNP/DNO/PMEG3050EP,115  [FP-SOD128-MFG]
D3  DNP/DNO/PMEG3050EP,115  [FP-SOD128-MFG]
Q2  FDC6327C  [FAIR-SOT23-6_V]  (parts A,B of 2)
R15  120k  [R0603B]
R16  100k  [R0603B]
R17  229k  [R0603B]
R18  100k  [R0603B]
R19  100k  [R0603B]
R20  1k  [R0603B]
R21  1k  [R0603B]
R22  100k  [R0603B]
R23  1k  [R0603B]
U2  TLV75101PDSQR  [TLV75101PDSQR-Footprint-1]

### Ports
1V2_PWR_OUT (out, see IMX385_EVB_revA[5A]), 1V8_PWR_OUT (out, see IMX385_EVB_revA[5A]), 3V3_PWR_IN (in, see IMX385_EVB_revA[5A]), 3V3_PWR_OUT (out, see IMX385_EVB_revA[5A])

### Nets
1V2_PWR_OUT: C50.2 C53.1 C54.1 D2.2(A) R21.1 U2.10(VOUT1) ; port 1V2_PWR_OUT
1V8_PWR_OUT: C55.2 C58.1 C59.1 D3.2(A) R23.1 U2.8(VOUT2) ; port 1V8_PWR_OUT
3V3: Q2.5(S) ; port 3V3_PWR_OUT
3V3_PWR_IN: C51.1 C52.1 C56.1 C57.1 D2.1(C) D3.1(C) Q2.6(D) R19.1 U2.3(EN1) U2.6(VIN2) U2.9(VIN1) ; port 3V3_PWR_IN
GND: C51.2 C52.2 C53.2 C54.2 C56.2 C57.2 C58.2 C59.2 C60.2 C61.2 Q2.2(S) R16.1 R18.1 R22.2 U2.2(GND) U2.4(GND) U2.11(EP_(GND))
3V3_EN_1V8: C60.1 R21.2 U2.5(EN2)
3V3_EN_3V3: C61.1 Q2.3(G) R22.1 R23.2
NetC50_1: C50.1 R15.1
NetC55_1: C55.1 R17.1
NetQ2_1: Q2.1(G) R19.2 R20.1
NetQ2_4: Q2.4(D) R20.2
NetR15_2: R15.2 R16.2 U2.1(FB1)
NetR17_2: R17.2 R18.2 U2.7(FB2)

### Notes on the sheet
- (near U2) 10n CAP HERE IS AS PER SECTION 8.1.7, FEED-FOWARD CAPACITOR. MIGHT IMPROVE NOISE PROFILE BUT CAN BE JUMPED IF NOT
- (near D3) I DON'T BELIEVE WE WILL EVER HAVE SIGNIFICANT REVERSE CURRENT ISSUES ON THIS BOARD BUT MIGHT AS WELL HAVE THE PADS FOR THESE AVAILABLE.
- CALCS BASED ON SECTION 8.1 OF DS
  FOR 1V8 RAIL:
  R1+R2 <= 1.8MOHM
  IF R2 = 100k, R1 = 227.273k (229k)
  CIN/COUT = 2x100n (ARBITRARY)
  FOR 1V2 RAIL:
  R1+R2 <= 1.2MOHM
  IF R2 = 100k, R1 = 118.182k (120k)
  CIN/COUT = 2x100n (ARBITRARY)
  IN EITHER CASE, VOLTAGE IS DESIGNED TO BE EVER SO SLIGHTLY ABOVE NOMINAL.
- (near C60) C_DELAY MARKED AS DNP SINCE PROB WON'T NEED IT
- AS PER P90 OF IMX385 DS, 1V2 RISES FIRST, THEN 1V8, AND FINALLY 3V3 BUT ALL SUPPLIES NEED TO FULLY RISE WITHIN 200MS

### Library data of the parts
C50-C61 = CMP-001-00058-1: as C1 on sheet IMX385_PINOUT; Min Operating Temperature: -55°C; Mounting Technology: Surface Mount; Pins: 2; Case/Package: 0402; RoHS Compliant: Yes; Max Operating Temperature: 85°C
D2 D3 = CMP-14398-000051-1: DIODE SCHOTTKY 30V 5A SOD128; RoHS Compliant: Yes
Q2 = CMP-2000-04939-1: Dual N & P-Channel 2.5 V Specified PowerTrench(TM) MOSFET, -55 to 150 degC, 6-Pin SOT-23, RoHS, Tape and Reel; Manufacturer: Fairchild; Typical Rise Time: 9@NChannel; Rad Hard: No; Maximum Drain Source Voltage: 20V; Typical Fall Time: 3@NChannel; Typical Turn-On Delay Time: 5@NChannel; Maximum Continuous Drain Current: 2.7@NChannel; Typical Turn-Off Delay Time: 12@NChannel; RDS-on: 80@4.5V@NChannel; Channel Mode: Enhancement; Maximum Gate Source Voltage: ±8V; Package Version: Rev. 5, 05/2015; Operating Temperature: -55to150degC; Packaging: Tape&Reel; Package Reference: SOT23-6; Package URL: https://www.fairchildsemi.com/package-drawings/MA/MA06A.pdf; Package Description: 6-Pin Small Outline Transistor, Body 2.9 x 1.6 mm, Pitch 0.95 mm; Manufacturer URL: https://www.fairchildsemi.com/; Channel Type: N; Datasheet Version: Rev. E, 07/2000; Package: 6SuperSOT; Datasheet URL: https://www.fairchildsemi.com/datasheets/FD/FDC6327C.pdf; Mounting: SurfaceMount; Category: MOSFET
R15-R23 = CMP-009-00002-14: Resistor
  R15: Value: 120k
  R16 R18 R19 R22: Value: 100k
  R17: Value: 229k
  R20 R21 R23: Value: 1k
U2 = CMP-019-00062-2: 500-mA, low-IQ, high-PSRR, dual-channel low-dropout (LDO) voltage regulator 10-WSON -40 to 125; Pins: 10

## Nets that join several sheets
1V2_PWR_OUT: IMX385_EVB_revA (J6.1), IMX385_PINOUT (39 pins), TLV751_PINOUT (6 pins)
1V8_PWR_OUT: IMX385_EVB_revA (6 pins), IMX385_PINOUT (18 pins), TLV751_PINOUT (6 pins)
3V3: IMX385_EVB_revA (D1.2 J3.1 R1.2 R5.2), IMX385_PINOUT (15 pins), TLV751_PINOUT (Q2.5)
3V3_PWR_IN: IMX385_EVB_revA (J4.1 P1.2), TLV751_PINOUT (11 pins)
GND: IMX385_EVB_revA (15 pins), IMX385_PINOUT (112 pins), TLV751_PINOUT (17 pins)
1V8_IMX385_INCK: IMX385_EVB_revA (R3.1 R4.1), IMX385_PINOUT (R9.2 U1.D7)
1V8_IMX385_nRST: IMX385_EVB_revA (D1.4 P4.2), IMX385_PINOUT (R11.2 U1.C6)
1V8_IMX385_SCK: IMX385_EVB_revA (J10.1 Q1.4 R6.1), IMX385_PINOUT (R13.1 U1.E5)
1V8_IMX385_SDA: IMX385_EVB_revA (J8.1 Q1.1 R2.1), IMX385_PINOUT (R12.1 U1.F5)
1V8_IMX385_XHS: IMX385_EVB_revA (J13.1), IMX385_PINOUT (U1.B6)
1V8_IMX385_XTRIG: IMX385_EVB_revA (J11.1), IMX385_PINOUT (U1.G5)
1V8_IMX385_XVS: IMX385_EVB_revA (J12.1), IMX385_PINOUT (U1.A6)
CSI_CK_N: IMX385_EVB_revA (J1.15), IMX385_PINOUT (U1.B9)
CSI_CK_P: IMX385_EVB_revA (J1.14), IMX385_PINOUT (U1.A9)
CSI_D0_N: IMX385_EVB_revA (J1.21), IMX385_PINOUT (U1.B8)
CSI_D0_P: IMX385_EVB_revA (J1.20), IMX385_PINOUT (U1.A8)
CSI_D1_N: IMX385_EVB_revA (J1.18), IMX385_PINOUT (U1.B10)
CSI_D1_P: IMX385_EVB_revA (J1.17), IMX385_PINOUT (U1.A10)
CSI_D2_N: IMX385_EVB_revA (J1.12), IMX385_PINOUT (U1.B7)
CSI_D2_P: IMX385_EVB_revA (J1.11), IMX385_PINOUT (U1.A7)
CSI_D3_N: IMX385_EVB_revA (J1.9), IMX385_PINOUT (U1.B11)
CSI_D3_P: IMX385_EVB_revA (J1.8), IMX385_PINOUT (U1.A11)